# Altium schematic sheet MCU_Block.SchDoc
size A4; SheetNumber: 3; SheetTotal: 15
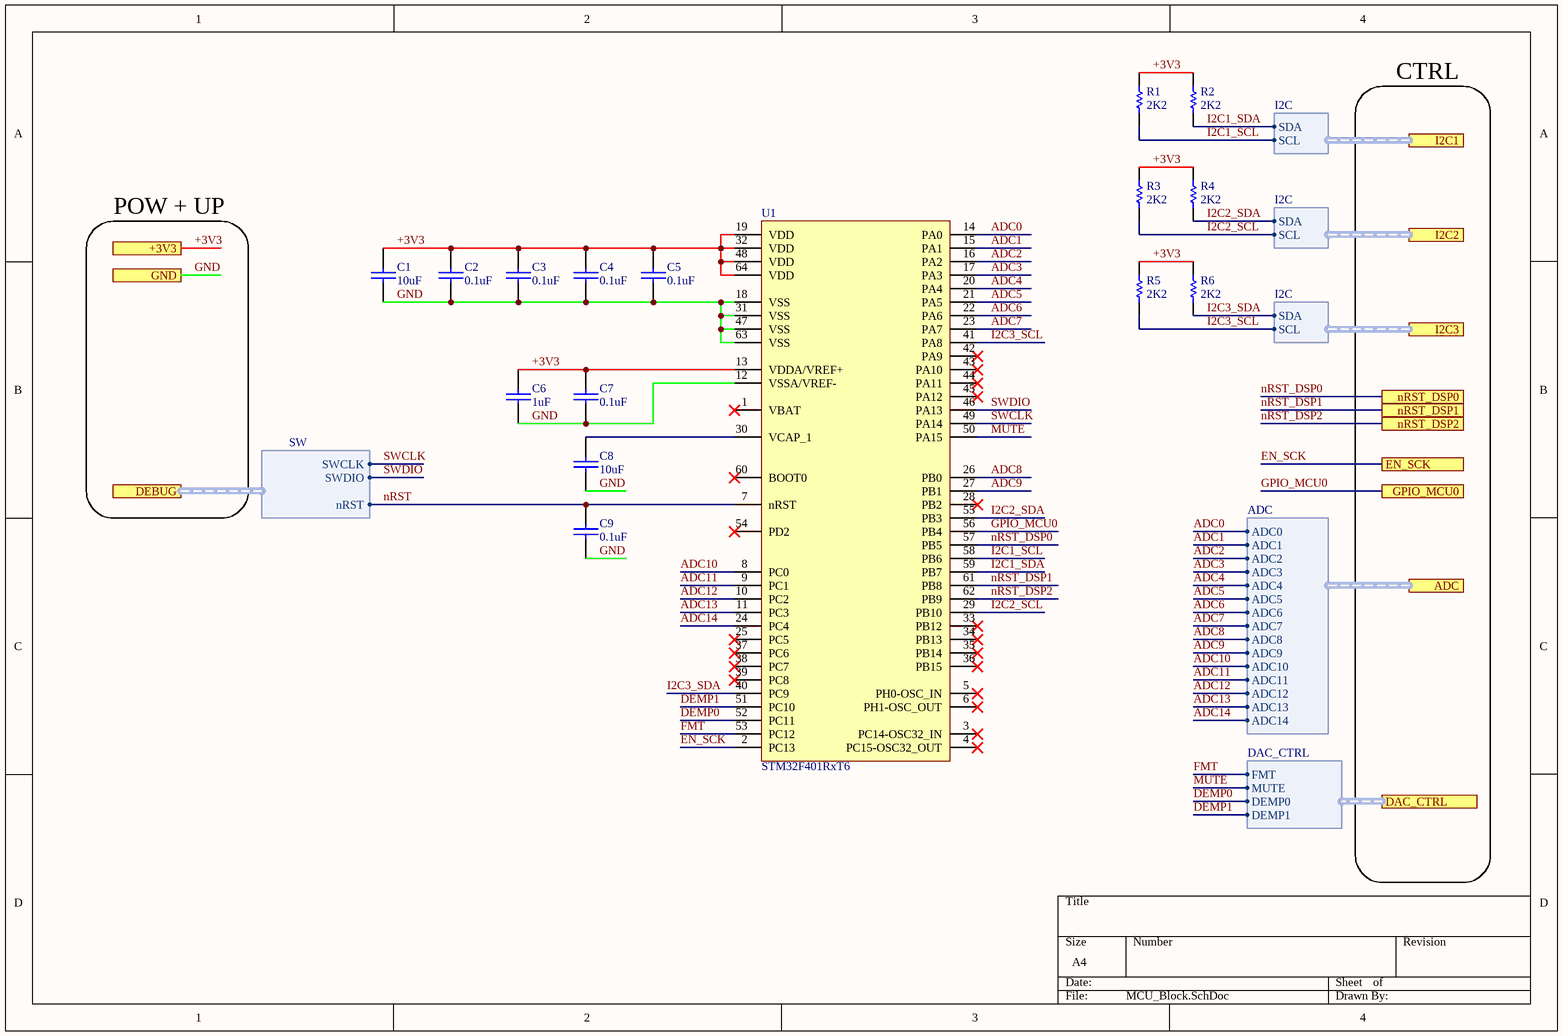
[diagram p0: MCU_Block.SchDoc]

## Parts
C1  10uF  [0603-CAP-TDK]
C2  0.1uF  [0402-CAP-TDK]
C3  0.1uF  [0402-CAP-TDK]
C4  0.1uF  [0402-CAP-TDK]
C5  0.1uF  [0402-CAP-TDK]
C6  1uF  [0603-CAP-TDK]
C7  0.1uF  [0402-CAP-TDK]
C8  10uF  [0603-CAP-TDK]
C9  0.1uF  [0402-CAP-TDK]
R1  2K2  [0402-RES-PANASONIC]
R2  2K2  [0402-RES-PANASONIC]
R3  2K2  [0402-RES-PANASONIC]
R4  2K2  [0402-RES-PANASONIC]
R5  2K2  [0402-RES-PANASONIC]
R6  2K2  [0402-RES-PANASONIC]
U1  STM32F401RxT6  [LQFP-64]

## Ports
+3V3, ADC (harness ADC), DAC_CTRL (harness DAC_CTRL), DEBUG (harness SW), EN_SCK, GND, GPIO_MCU0, I2C1 (harness I2C), I2C2 (harness I2C), I2C3 (harness I2C), nRST_DSP0, nRST_DSP1, nRST_DSP2

## Harnesses
SW: SWCLK, SWDIO, nRST
ADC: ADC0, ADC1, ADC2, ADC3, ADC4, ADC5, ADC6, ADC7, ADC8, ADC9, ADC10, ADC11, ADC12, ADC13, ADC14
I2C: SCL, SDA
DAC_CTRL: FMT, MUTE, DEMP0, DEMP1

## Nets
+3V3: C1.2 C2.2 C3.2 C4.2 C5.2 C6.2 C7.2 R1.2 R2.2 R3.2 R4.2 R5.2 R6.2 U1.13(VDDA/VREF+) U1.19(VDD) U1.32(VDD) U1.48(VDD) U1.64(VDD) ; port +3V3
ADC0: U1.14(PA0) ; port ADC.ADC0
ADC1: U1.15(PA1) ; port ADC.ADC1
ADC2: U1.16(PA2) ; port ADC.ADC2
ADC3: U1.17(PA3) ; port ADC.ADC3
ADC4: U1.20(PA4) ; port ADC.ADC4
ADC5: U1.21(PA5) ; port ADC.ADC5
ADC6: U1.22(PA6) ; port ADC.ADC6
ADC7: U1.23(PA7) ; port ADC.ADC7
ADC8: U1.26(PB0) ; port ADC.ADC8
ADC9: U1.27(PB1) ; port ADC.ADC9
ADC10: U1.8(PC0) ; port ADC.ADC10
ADC11: U1.9(PC1) ; port ADC.ADC11
ADC12: U1.10(PC2) ; port ADC.ADC12
ADC13: U1.11(PC3) ; port ADC.ADC13
ADC14: U1.24(PC4) ; port ADC.ADC14
DEMP0: U1.52(PC11) ; port DAC_CTRL.DEMP0
DEMP1: U1.51(PC10) ; port DAC_CTRL.DEMP1
EN_SCK: U1.2(PC13) ; port EN_SCK
FMT: U1.53(PC12) ; port DAC_CTRL.FMT
GND: C1.1 C2.1 C3.1 C4.1 C5.1 C6.1 C7.1 C8.1 C9.1 U1.12(VSSA/VREF-) U1.18(VSS) U1.31(VSS) U1.47(VSS) U1.63(VSS) ; port GND
GPIO_MCU0: U1.56(PB4) ; port GPIO_MCU0
I2C1_SCL: R1.1 U1.58(PB6) ; port I2C1.SCL
I2C1_SDA: R2.1 U1.59(PB7) ; port I2C1.SDA
I2C2_SCL: R3.1 U1.29(PB10) ; port I2C2.SCL
I2C2_SDA: R4.1 U1.55(PB3) ; port I2C2.SDA
I2C3_SCL: R5.1 U1.41(PA8) ; port I2C3.SCL
I2C3_SDA: R6.1 U1.40(PC9) ; port I2C3.SDA
MUTE: U1.50(PA15) ; port DAC_CTRL.MUTE
nRST: C9.2 U1.7(nRST) ; port DEBUG.nRST
nRST_DSP0: U1.57(PB5) ; port nRST_DSP0
nRST_DSP1: U1.61(PB8) ; port nRST_DSP1
nRST_DSP2: U1.62(PB9) ; port nRST_DSP2
SWCLK: U1.49(PA14) ; port DEBUG.SWCLK
SWDIO: U1.46(PA13) ; port DEBUG.SWDIO
NetC8_2: C8.2 U1.30(VCAP_1)

Not connected (* = marked no-connect by the designer): U1 1(VBAT)* 3(PC14-OSC32_IN)* 4(PC15-OSC32_OUT)* 5(PH0-OSC_IN)* 6(PH1-OSC_OUT)* 25(PC5)* 28(PB2)* 33(PB12)* 34(PB13)* 35(PB14)* 36(PB15)* 37(PC6)* 38(PC7)* 39(PC8)* 42(PA9)* 43(PA10)* 44(PA11)* 45(PA12)* 54(PD2)* 60(BOOT0)*

## Notes on the sheet
- CTRL
- POW + UP

## Library data of the parts
C1-C9 = CAP-SMD
  C1 C8: JLCPart: C96446
  C2-C5 C7 C9: JLCPart: C307331
  C6: JLCPart: C15849
R1-R6 = RES-SMD: JLCPart: C25879
U1 = STM32F401RxT6: JLCPart: C74524